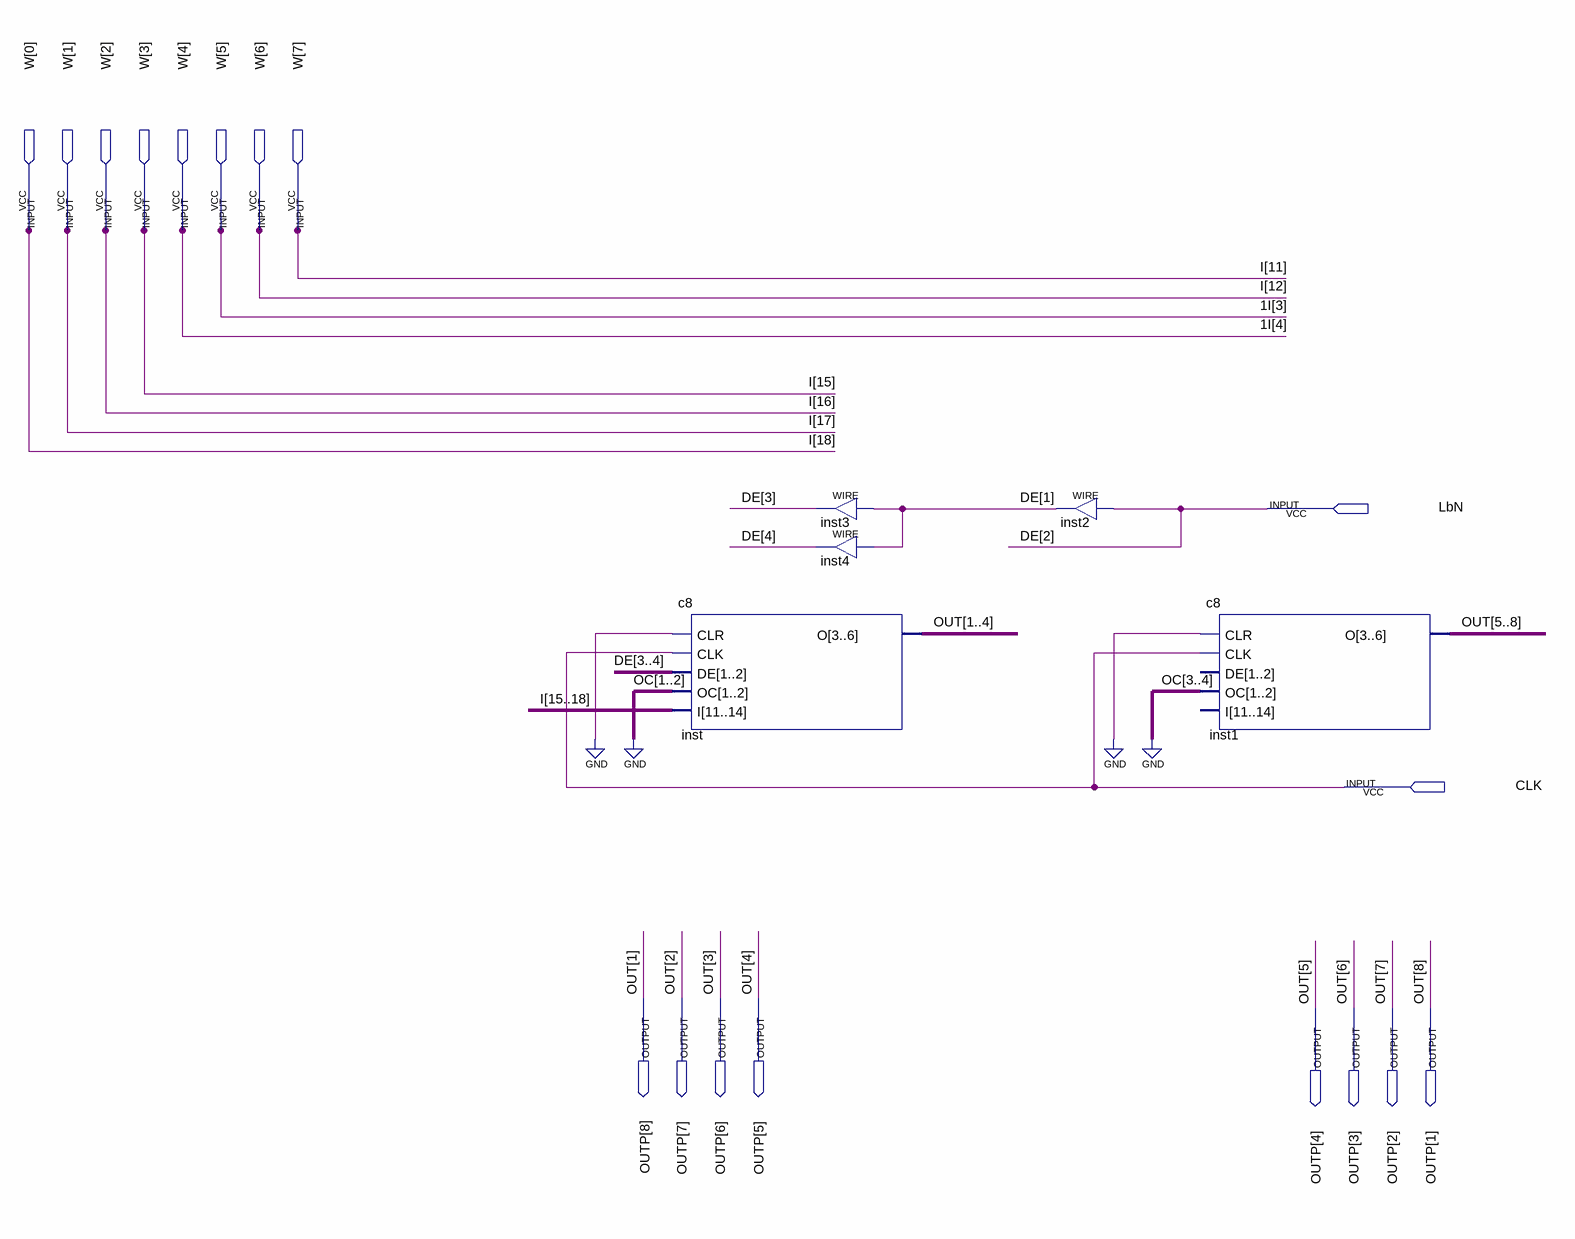
[diagram p0: schematic sheet]
// Quartus schematic B_register.bdf as structural Verilog: 5 symbols, 18 pins
module B_register (
  input  [7:0] W,
  input  LbN,
  input  CLK,
  output [8:1] OUTP
);

  wire [4:1] DE;

  c8 inst (.CLR(1'b0), .CLK(CLK), .DE({DE[3], DE[4]}), .OC(2'b00), .I(W[3:0]), .O(OUTP[8:5]));
  assign DE[3] = DE[1];  // WIRE inst3
  assign DE[4] = DE[1];  // WIRE inst4
  assign DE[1] = LbN;  // WIRE inst2
  c8 inst1 (.CLR(1'b0), .CLK(CLK), .OC(2'b00), .O(OUTP[4:1]));  // open: DE, I

  // Other names for the same wires on the sheet: 1I[4:3] = {W[4], W[5]}; DE[2] = LbN;
  //   I (some bits) = {W[0], W[1], W[2], W[3], W[6], W[7]};
  //   OUT[8:1] = {OUTP[1], OUTP[2], OUTP[3], OUTP[4], OUTP[5], OUTP[6], OUTP[7], OUTP[8]}
endmodule
